# Altium schematic sheet Sheet1.SchDoc
size A4
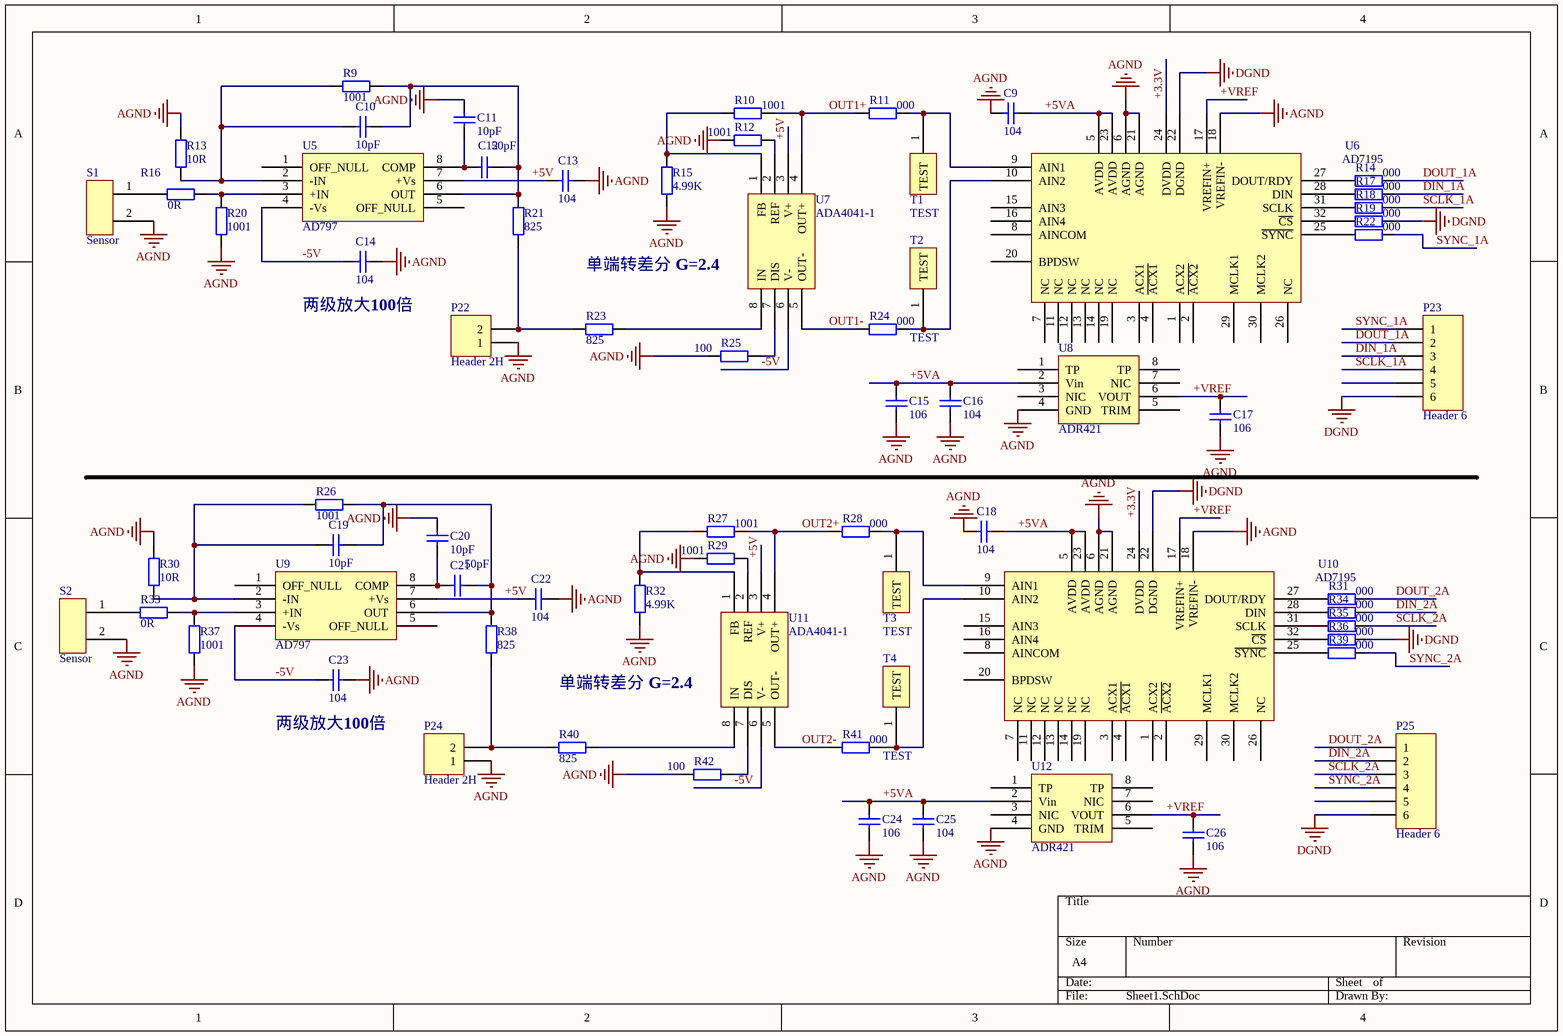
[diagram p0: Sheet1.SchDoc]

## Parts
C9  104  [0805C]
C10  10pF  [0805C]
C11  10pF  [0805C]
C12  50pF  [0805C]
C13  104  [0805C]
C14  104  [0805C]
C15  106  [0805C]
C16  104  [0805C]
C17  106  [0805C]
C18  104  [0805C]
C19  10pF  [0805C]
C20  10pF  [0805C]
C21  50pF  [0805C]
C22  104  [0805C]
C23  104  [0805C]
C24  106  [0805C]
C25  104  [0805C]
C26  106  [0805C]
P22  Header 2H  [HDR1X2]
P23  Header 6  [HDR1X6]
P24  Header 2H  [HDR1X2]
P25  Header 6  [HDR1X6]
R9  1001  [0805R]  (net tie, no BOM)
R10  1001  [0805R]  (net tie, no BOM)
R11  000  [0805R]  (net tie, no BOM)
R12  1001  [0805R]  (net tie, no BOM)
R13  10R  [0805R]
R14  000  [0805R]  (net tie, no BOM)
R15  4.99K  [0805R]  (net tie, no BOM)
R16  0R  [0805R]
R17  000  [0805R]  (net tie, no BOM)
R18  000  [0805R]  (net tie, no BOM)
R19  000  [0805R]  (net tie, no BOM)
R20  1001  [0805R]  (net tie, no BOM)
R21  825  [0805R]  (net tie, no BOM)
R22  000  [0805R]  (net tie, no BOM)
R23  825  [0805R]  (net tie, no BOM)
R24  000  [0805R]  (net tie, no BOM)
R25  100  [0805R]  (net tie, no BOM)
R26  1001  [0805R]  (net tie, no BOM)
R27  1001  [0805R]  (net tie, no BOM)
R28  000  [0805R]  (net tie, no BOM)
R29  1001  [0805R]  (net tie, no BOM)
R30  10R  [0805R]  (net tie, no BOM)
R31  000  [0805R]  (net tie, no BOM)
R32  4.99K  [0805R]  (net tie, no BOM)
R33  0R  [0805R]  (net tie, no BOM)
R34  000  [0805R]  (net tie, no BOM)
R35  000  [0805R]  (net tie, no BOM)
R36  000  [0805R]  (net tie, no BOM)
R37  1001  [0805R]  (net tie, no BOM)
R38  825  [0805R]  (net tie, no BOM)
R39  000  [0805R]  (net tie, no BOM)
R40  825  [0805R]  (net tie, no BOM)
R41  000  [0805R]  (net tie, no BOM)
R42  100  [0805R]  (net tie, no BOM)
S1  Sensor  [HDR1X2]
S2  Sensor  [HDR1X2]
T1  TEST  [TEST]
T2  TEST  [TEST]
T3  TEST  [TEST]
T4  TEST  [TEST]
U5  AD797  [SO8]
U6  AD7195  [LFCSP32]
U7  ADA4041-1  [SO8]
U8  ADR421  [SO8]
U9  AD797  [SO8]
U10  AD7195  [LFCSP32]
U11  ADA4041-1  [SO8]
U12  ADR421  [SO8]

## Nets
AGND: C9.1 C11.2 C13.1 C14.1 C15.2 C16.2 C17.2 C18.1 C20.2 C22.1 C23.1 C24.2 C25.2 C26.2 P22.1 P24.1 R12.1 R13.1 R15.1 R20.1 R25.1 R29.1 R30.1 R32.1 R37.1 R42.1 S1.2 S2.2 U6.6(AGND) U6.18(VREFIN-) U6.21(AGND) U8.4(GND) U10.6(AGND) U10.18(VREFIN-) U10.21(AGND) U12.4(GND)
DGND: P23.6 P25.6 R19.2 R36.2 U6.22(DGND) U10.22(DGND)
+3.3V: U6.24(DVDD) U10.24(DVDD)
+5V: C13.2 C22.2 U5.7(+Vs) U7.3(V+) U9.7(+Vs) U11.3(V+)
+5VA: C9.2 C15.1 C16.1 C18.2 C24.1 C25.1 U6.5(AVDD) U6.23(AVDD) U8.2(Vin) U10.5(AVDD) U10.23(AVDD) U12.2(Vin)
+VREF: C17.1 C26.1 U6.17(VREFIN+) U8.6(VOUT) U10.17(VREFIN+) U12.6(VOUT)
-5V: C14.2 C23.2 U5.4(-Vs) U7.6(V-) U9.4(-Vs) U11.6(V-)
DIN_1A: P23.3 R17.2
DIN_2A: P25.2 R34.2
DOUT_1A: P23.2 R14.2
DOUT_2A: P25.1 R31.2
OUT1+: R10.2 R11.1 U7.4(OUT+)
OUT1-: R24.1 U7.5(OUT-)
OUT2+: R27.2 R28.1 U11.4(OUT+)
OUT2-: R41.1 U11.5(OUT-)
SCLK_1A: P23.4 R18.2
SCLK_2A: P25.3 R35.2
SYNC_1A: P23.1 R22.2
SYNC_2A: P25.4 R39.2
NetC10_1: C10.1 C12.1 R9.2 R21.2 U5.6(OUT)
NetC10_2: C10.2 R9.1 R13.2 U5.2(-IN)
NetC11_1: C11.1 C12.2 U5.8(COMP)
NetC19_1: C19.1 C21.1 R26.2 R38.2 U9.6(OUT)
NetC19_2: C19.2 R26.1 R30.2 U9.2(-IN)
NetC20_1: C20.1 C21.2 U9.8(COMP)
NetP22_2: P22.2 R21.1 R23.1
NetP24_2: P24.2 R38.1 R40.1
NetR10_1: R10.1 R15.2 U7.1(FB)
NetR11_2: R11.2 T1.1(TEST) U6.9(AIN1)
NetR12_2: R12.2 U7.2(REF)
NetR14_1: R14.1 U6.27(DOUT/RDY)
NetR16_1: R16.1 S1.1
NetR16_2: R16.2 R20.2 U5.3(+IN)
NetR17_1: R17.1 U6.28(DIN)
NetR18_1: R18.1 U6.31(SCLK)
NetR19_1: R19.1 U6.32(~{CS})
NetR22_1: R22.1 U6.25(~{SYNC})
NetR23_2: R23.2 U7.8(IN)
NetR24_2: R24.2 T2.1(TEST) U6.10(AIN2)
NetR25_2: R25.2 U7.7(DIS)
NetR27_1: R27.1 R32.2 U11.1(FB)
NetR28_2: R28.2 T3.1(TEST) U10.9(AIN1)
NetR29_2: R29.2 U11.2(REF)
NetR31_1: R31.1 U10.27(DOUT/RDY)
NetR33_1: R33.1 S2.1
NetR33_2: R33.2 R37.2 U9.3(+IN)
NetR34_1: R34.1 U10.28(DIN)
NetR35_1: R35.1 U10.31(SCLK)
NetR36_1: R36.1 U10.32(~{CS})
NetR39_1: R39.1 U10.25(~{SYNC})
NetR40_2: R40.2 U11.8(IN)
NetR41_2: R41.2 T4.1(TEST) U10.10(AIN2)
NetR42_2: R42.2 U11.7(DIS)

Not connected (* = marked no-connect by the designer): P23 5; P25 5; U5 1(OFF_NULL) 5(OFF_NULL); U6 1(ACX2) 2(~{ACX2}) 3(ACX1) 4(~{ACX1}) 7(NC) 8(AINCOM) 11(NC) 12(NC) 13(NC) 14(NC) 15(AIN3) 16(AIN4) 19(NC) 20(BPDSW) 26(NC) 29(MCLK1) 30(MCLK2); U8 1(TP) 3(NIC) 5(TRIM) 7(NIC) 8(TP); U9 1(OFF_NULL) 5(OFF_NULL); U10 1(ACX2) 2(~{ACX2}) 3(ACX1) 4(~{ACX1}) 7(NC) 8(AINCOM) 11(NC) 12(NC) 13(NC) 14(NC) 15(AIN3) 16(AIN4) 19(NC) 20(BPDSW) 26(NC) 29(MCLK1) 30(MCLK2); U12 1(TP) 3(NIC) 5(TRIM) 7(NIC) 8(TP)

## Notes on the sheet
- (near C14) 两级放大100倍
- 单端转差分 G=2.4
- (near C23) 两级放大100倍

## Library data of the parts
C9-C26 = Cap: Capacitor; Value: 100nF; Published: 8-Jun-2000; LatestRevisionDate: 17-Jul-2002; LatestRevisionNote: Re-released for DXP Platform.; PackageReference: RAD-0.3; Publisher: Altium Limited
P22 P24 = Header 2H: Header, 2-Pin, Right Angle; LatestRevisionDate: 17-Jul-2002; LatestRevisionNote: Re-released for DXP Platform.; Publisher: Altium Limited
P23 P25 = Header 6: Header, 6-Pin; LatestRevisionDate: 17-Jul-2002; LatestRevisionNote: Re-released for DXP Platform.; Publisher: Altium Limited
R9-R15 R17-R32 R34-R42 = Res2: Resistor; Value: 1K; Published: 8-Jun-2000; LatestRevisionDate: 17-Jul-2002; LatestRevisionNote: Re-released for DXP Platform.; PackageReference: AXIAL-0.4; Publisher: Altium Limited
R16 R33 = Res2: Resistor; Value: 0; Published: 8-Jun-2000; LatestRevisionDate: 17-Jul-2002; LatestRevisionNote: Re-released for DXP Platform.; PackageReference: AXIAL-0.4; Publisher: Altium Limited